# EAGLE design pcb_aux_sensors (EAGLE 7.2.0)
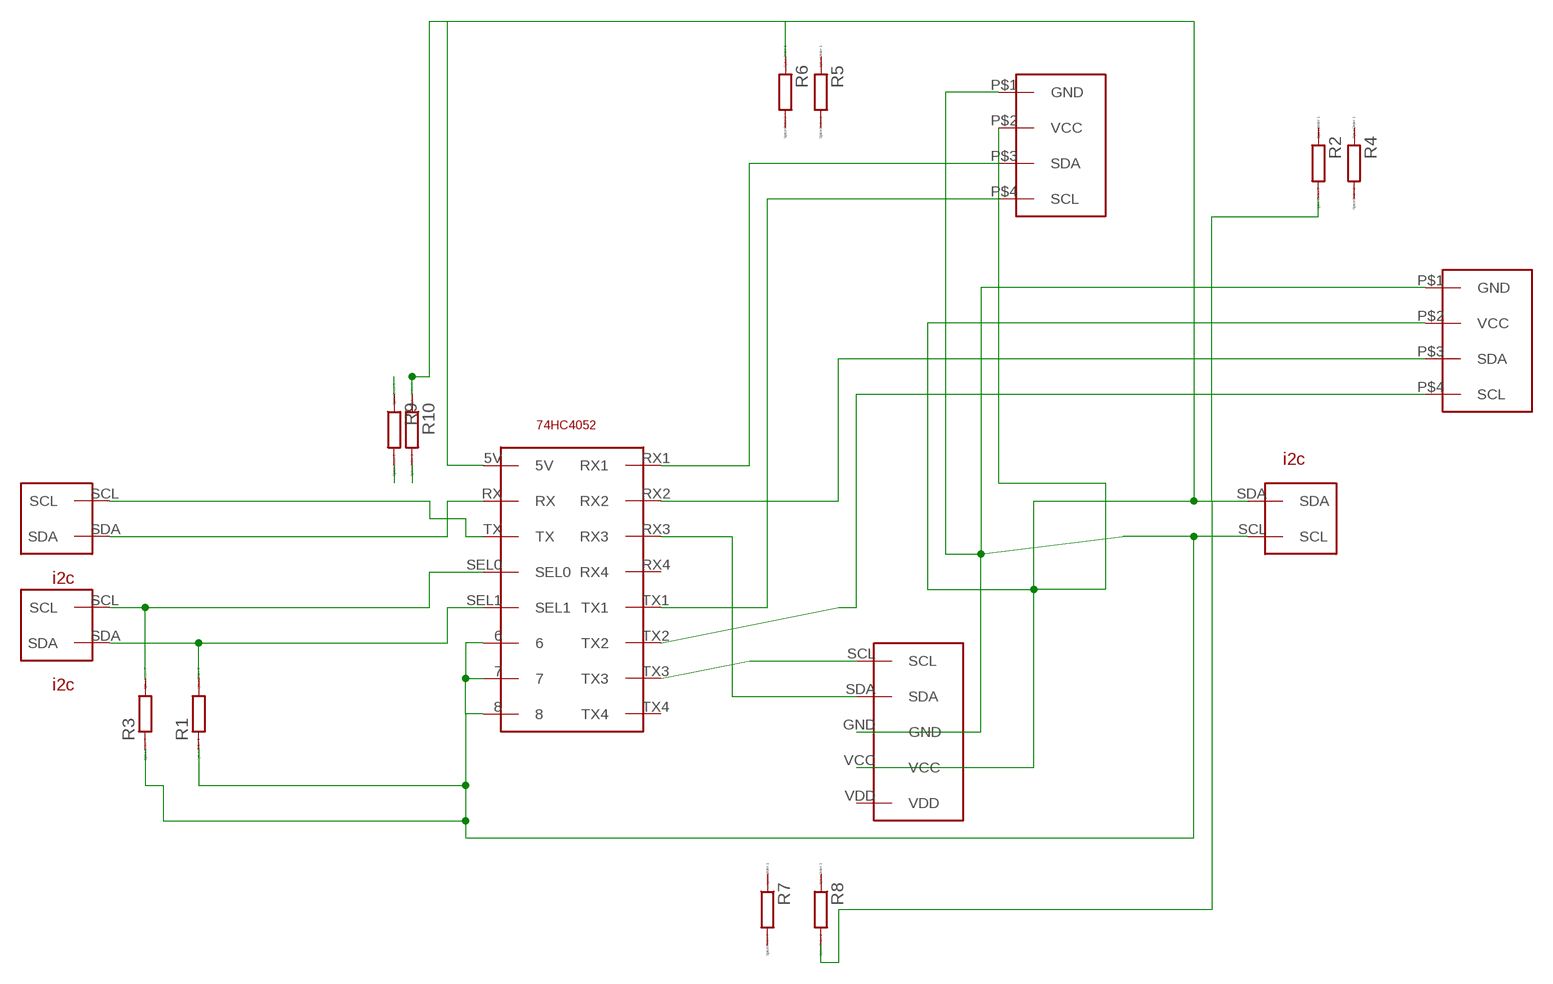
[diagram p0: schematic, sheet 1]

## Parts
I2C  I2C  [I2C]
MUXSELECT  I2C  [I2C]
PWR  I2C  [I2C]
R1  R0204/7  [0204/7]
R2  R0204/7  [0204/7]
R3  R0204/7  [0204/7]
R4  R0204/7  [0204/7]
R5  R0204/7  [0204/7]
R6  R0204/7  [0204/7]
R7  R0204/7  [0204/7]
R8  R0204/7  [0204/7]
R9  R0204/7  [0204/7]
R10  R0204/7  [0204/7]
U$2  74HC4052  [74HC4052]
U$5  GROVECOLORSENSOR  [GROVECOLORSENSOR]
U$6  GROVECOLORSENSOR  [GROVECOLORSENSOR]
U$7  MINIMU9_V4  [MINIMU9_V4]

## Nets
GND: PWR.SCL R1.1 R3.1 U$2.6 U$2.7 U$2.8 U$5.P$1(GND) U$6.P$1(GND) U$7.GND
N$1: R10.2
N$2: R9.2
N$3: R9.1
N$9: I2C.SDA U$2.RX
N$10: I2C.SCL U$2.TX
N$11: U$2.RX1 U$5.P$3(SDA)
N$12: U$2.TX1 U$5.P$4(SCL)
N$13: U$2.RX2 U$6.P$3(SDA)
N$14: U$2.TX2 U$6.P$4(SCL)
N$15: U$2.RX3 U$7.SDA
N$16: U$2.TX3 U$7.SCL
N$17: MUXSELECT.SCL R3.2 U$2.SEL0
N$18: MUXSELECT.SDA R1.2 U$2.SEL1
VCC: PWR.SDA R2.2 R6.1 R8.2 R10.1 U$2.5V U$5.P$2(VCC) U$6.P$2(VCC) U$7.VCC
Unconnected: R2.1 R4.1 R4.2 R5.1 R5.2 R6.2 R7.1 R7.2 R8.1 U$2.RX4 U$2.TX4 U$7.VDD

## Library data of the parts
I2C MUXSELECT PWR = perceptrons:I2C
R1-R10 = eagle-ltspice:R: RESISTOR, European symbol; SPICEMODEL: NONE; SPICEPREFIX: R
U$2 = perceptrons:74HC4052
U$5 U$6 = perceptrons:GROVECOLORSENSOR
U$7 = perceptrons:MINIMU9_V4

## Board
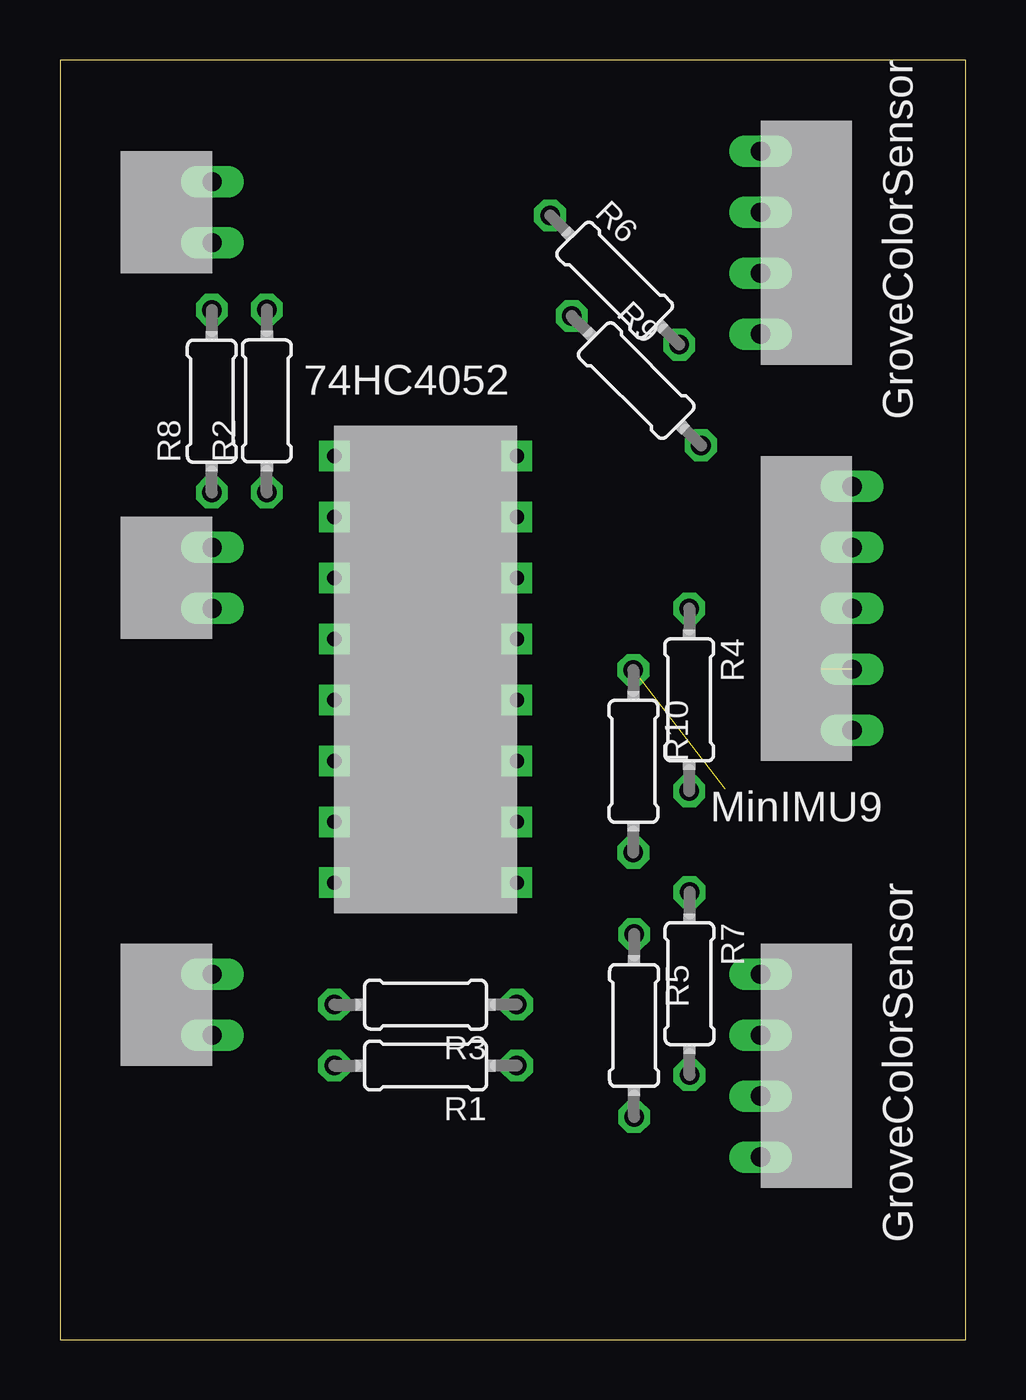
[diagram p1: board, top side]
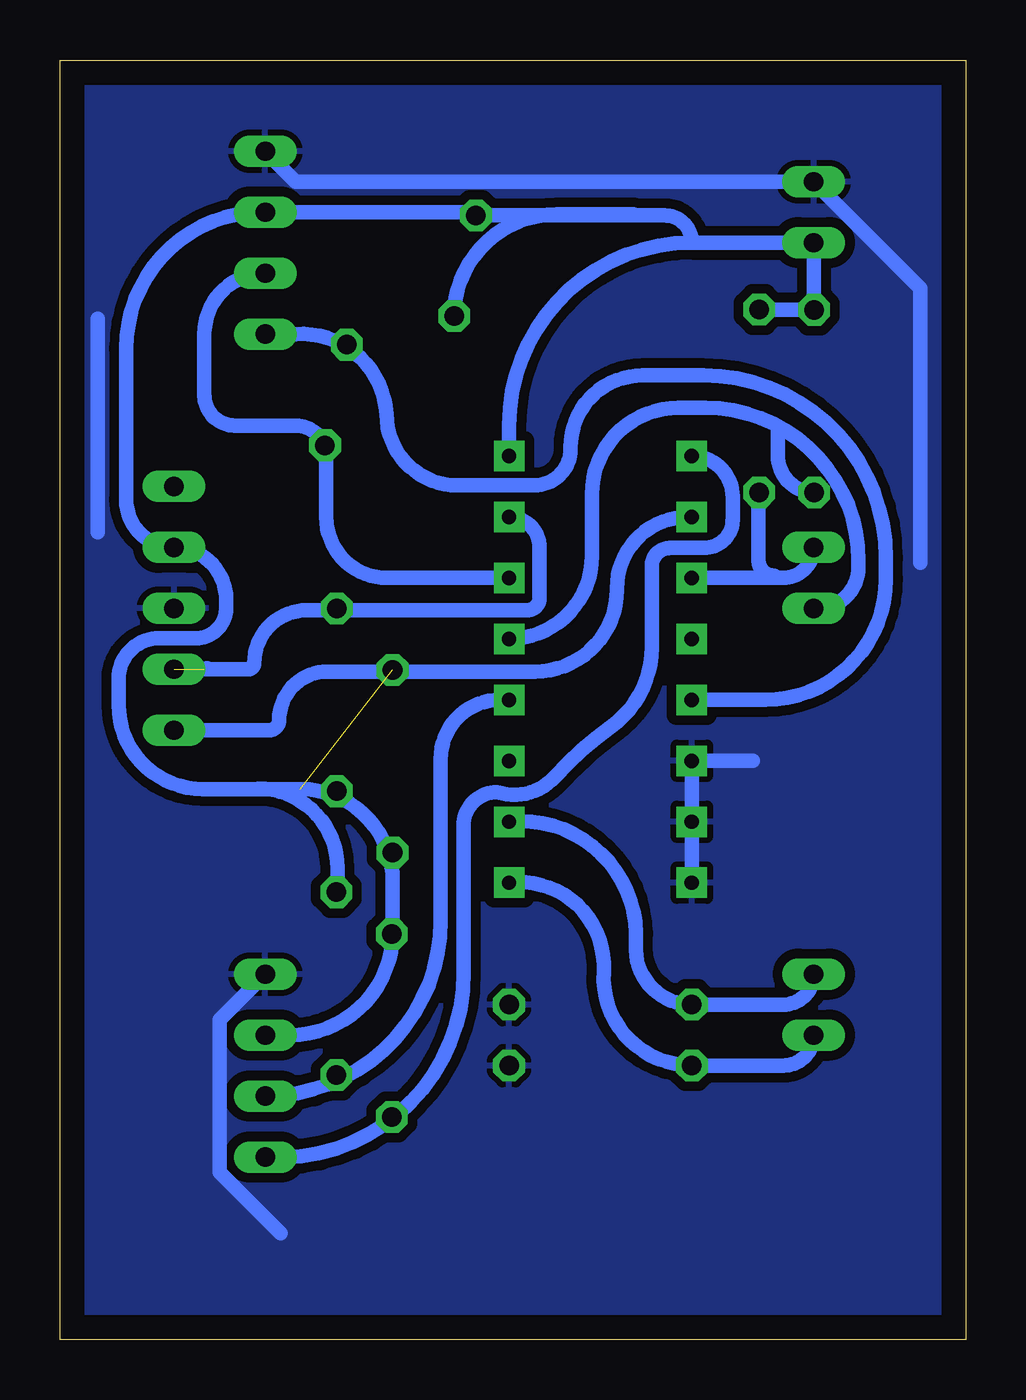
[diagram p2: board, bottom side, seen from below]

Size 37.77 x 53.33 mm. Coordinates in mm from the lower left corner, seen from the top.
Outline: 0,0 37.77,0 37.77,53.33 0,53.33 0,0
Copper layers (1*16): Top 0.035mm / dielectric 1.5mm / Bottom 0.035mm
Design rules "default *": minimum track width 24mil, minimum drill 24mil, track to track 8mil, track to pad 8mil, pad to pad 8mil, via to via 8mil, smd to smd 8mil, copper to edge 40mil, drill to drill 8mil, minimum pad ring 10mil, minimum via ring 8mil, stop-mask expansion 4mil, vias tented up to drill 0mil, thermal gap 10mil

### Footprints (pad centres in the part's own frame; a part is rotated, then mirrored left to right if it is on the bottom)
I2C = drill 0.8 long: SCL -10.16,1.27; SDA -10.16,3.81
0204/7 = drill 0.813 octagon: 1 -3.81,0; 2 3.81,0
74HC4052 = drill 0.6 pad 1.27 square: 5V 2.54,16.51; 6 -5.08,3.81; 7 -5.08,1.27; 8 -5.08,-1.27; RX 2.54,8.89; RX1 2.54,6.35; RX2 2.54,11.43; RX3 2.54,13.97; RX4 2.54,3.81; SEL0 2.54,1.27; SEL1 2.54,-1.27; TX -5.08,11.43; TX1 -5.08,16.51; TX2 -5.08,6.35; TX3 -5.08,13.97; TX4 -5.08,8.89
GROVECOLORSENSOR = drill 0.8 long: P$1 -7.62,5.08; P$2 -7.62,2.54; P$3 -7.62,0; P$4 -7.62,-2.54
MINIMU9_V4 = drill 0.8 long: GND -2.54,2.54; SCL -2.54,7.62; SDA -2.54,5.08; VCC -2.54,0; VDD -2.54,-2.54

### Placement (x,y rotation side)
I2C  -3.81,34.29 180 top
MUXSELECT  -3.81,16.51 180 top
PWR  -3.81,49.53 180 top
R1  15.24,11.43 180 top
R2  8.62,39.13 90 top
R3  15.24,13.97 180 top
R4  26.23,26.67 270 top
R5  23.93,13.1 270 top
R6  23.12,44.16 315 top
R7  26.24,14.84 270 top
R8  6.33,39.11 90 top
R9  24.02,39.97 315 top
R10  23.91,24.11 270 top
U$2  16.51,20.32 0 top
U$5  36.83,10.16 0 top
U$6  36.83,44.45 0 top
U$7  30.48,33.02 180 top

### Tracks (layer width: path | path; a pad name or v marks a point on that pad's centre or on a via)
GND
  Bottom 0.61: U$5.P$1 31.11,13.34 31.11,6.98 28.57,4.44 | U$2.8 U$2.7 U$2.6 8.89,24.13 | U$6.P$1 27.94,48.26 PWR.SCL 1.91,43.81 1.91,32.38 | 36.2,42.55 36.2,33.66
  pour Bottom (isolate 0.406): 0,53.34 38.1,53.34 38.1,0 0,0 0,1.27
N$4
  Bottom 0.61: 21.36,42.58 arc90 17.05,46.9 13.87,46.9
N$5
  Bottom 0.61: 6.29,35.3 arc90 7.84,36.86 7.84,38.02
N$6
  Bottom 0.61: 8.66,35.29 8.66,32.5 arc-90 8,31.84
N$7
  Bottom 0.61: 26.2,18.6 26.2,19.66 arc-90 29.52,22.97
N$9
  Bottom 0.61: I2C.SDA 6.21,30.48 arc-90 4.48,32.21 4.48,32.46 arc-90 10.86,38.84 11.99,38.84 arc-90 15.6,35.24 15.6,32.66 arc90 U$2.RX
N$10
  Bottom 0.61: I2C.SCL arc90 7.62,31.75 U$2.TX
N$11
  Bottom 0.61: U$2.RX1 19.43,26.67 arc-90 21.9,24.2 21.9,17.47 arc90 U$5.P$3
N$12
  Bottom 0.61: U$2.TX1 arc90 9.72,35.12 9.72,34.2 arc90 10.92,33 12.34,33 arc-90 13.1,32.24 13.1,28.86 arc54 14.81,25.54 arc-12 17.14,23.46 arc66 19.54,22.83 arc-90 20.95,21.41 arc0 20.94,15.31 arc95 U$5.P$4
N$13
  Bottom 0.61: U$6.P$3 arc-90 31.75,41.91 31.75,39.37 arc-90 30.48,38.1 27.94,38.1 arc90 26.67,36.83 26.67,34.29 arc-90 24.13,31.75 U$2.RX2
N$14
  Bottom 0.61: U$6.P$4 27.94,41.91 arc90 24.16,38.57 arc-90 21.19,35.61 18,35.61 arc-90 16.48,37.12 16.48,37.2 arc90 13.49,40.19 10.95,40.19 arc90 3.33,32.58 3.33,31.7 arc90 8.37,26.67 U$2.TX2
N$15  (1 unrouted)
  Bottom 0.61: 31.75,27.94 arc-45 31.64,27.99 | U$2.RX3 arc90 17.77,33.01 17.77,30.91 arc90 18.28,30.41 27.46,30.41 arc-90 29.68,28.2 arc90 29.93,27.94 U$7.SDA
N$16
  Bottom 0.61: U$2.TX3 11.59,34.29 arc-90 14.55,31.32 14.55,31.26 arc90 17.96,27.85 26.61,27.85 arc-90 28.63,25.83 arc90 29.06,25.4 U$7.SCL
N$17
  Bottom 0.61: MUXSELECT.SCL arc90 7.62,13.97 R3.2 arc94 13.76,16.47 arc-100 U$2.SEL0
N$18
  Bottom 0.61: MUXSELECT.SDA arc90 7.62,11.43 R1.2 arc94 15.1,15.34 arc-101 U$2.SEL1
VCC  (1 unrouted)
  Bottom 0.61: 11.43,45.72 PWR.SDA 6.35,43.21 arc90 R8.2 8.61,42.92 arc90 R2.2 | 11.43,45.72 arc-90 19.05,38.1 U$2.5V | 11.43,45.72 arc-90 12.56,46.86 R6.1 arc-90 20.56,46.99 U$6.P$2 29.32,46.99 arc-90 35.01,41.3 35.01,35.01 arc-90 U$7.VCC arc90 30.84,30.84 30.84,30.5 arc90 32.11,29.24 33.62,29.24 arc-90 35.33,27.53 35.33,26.46 arc-90 31.82,22.95 27.75,22.95 arc90 23.9,19.1 23.9,16.98 arc90 28.18,12.7 U$5.P$2